# Altium schematic sheet ethernet.SchDoc
size A3; DocumentNumber: 6; SheetNumber: 6; SheetTotal: 45; SheetDescription: Ethernet Communication
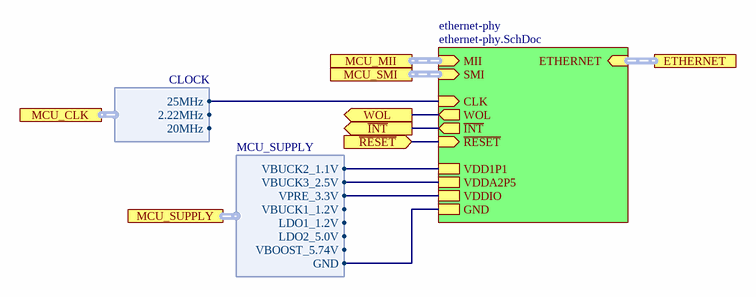
[diagram p0: ethernet.SchDoc]

## Sub-sheets
ethernet-phy = ethernet-phy.SchDoc: ~{RESET} (in), WOL (out), CLK (in), ~{INT} (out), GND, VDDA2P5, VDD1P1, VDDIO, ETHERNET (in, harness ETHERNET), MII (in, harness MCU_MII), SMI (in, harness MCU_SMI)

## Ports
ETHERNET (harness ETHERNET), MCU_CLK (harness CLOCK), MCU_MII (harness MCU_MII), MCU_SMI (harness MCU_SMI), MCU_SUPPLY (harness MCU_SUPPLY), WOL (out), ~{INT} (out), ~{RESET} (in)

## Harnesses
CLOCK: 2.22MHz, 20MHz, 25MHz
MCU_SUPPLY: VBUCK1_1.2V, VBUCK2_1.1V, VBUCK3_2.5V, LDO1_1.2V, LDO2_5.0V, GND, VPRE_3.3V, VBOOST_5.74V

## Nets
~{INT}: port ~{INT}, sheet ethernet-phy/~{INT}
~{RESET}: port ~{RESET}, sheet ethernet-phy/~{RESET}
WOL: port WOL, sheet ethernet-phy/WOL
(unnamed): sheet ethernet-phy/CLK, port MCU_CLK.25MHz
(unnamed): sheet ethernet-phy/GND, port MCU_SUPPLY.GND
(unnamed): sheet ethernet-phy/VDDA2P5, port MCU_SUPPLY.VBUCK3_2.5V
(unnamed): sheet ethernet-phy/VDD1P1, port MCU_SUPPLY.VBUCK2_1.1V
(unnamed): sheet ethernet-phy/VDDIO, port MCU_SUPPLY.VPRE_3.3V

## Buses and harness runs
harness port ETHERNET = sheet ethernet-phy/ETHERNET
harness port MCU_MII = sheet ethernet-phy/MII
harness port MCU_SMI = sheet ethernet-phy/SMI

## Notes on the sheet
- Fraunhofer IISB
- Schottkystr. 10
- developed by:
- 91058 Erlangen
- Germany
- Author
- Project
- License
- Description
- File
- Version
- Release Date
- Sheet
- foxbms.org <https://foxbms.org>
- www.iisb.fraunhofer.de <https://www.iisb.fraunhofer.de/>
- foxBMS Team
- /